# EAGLE schematic Wheel_Encoder_Adapter_Schmitt_7414 (EAGLE 7.1.0)
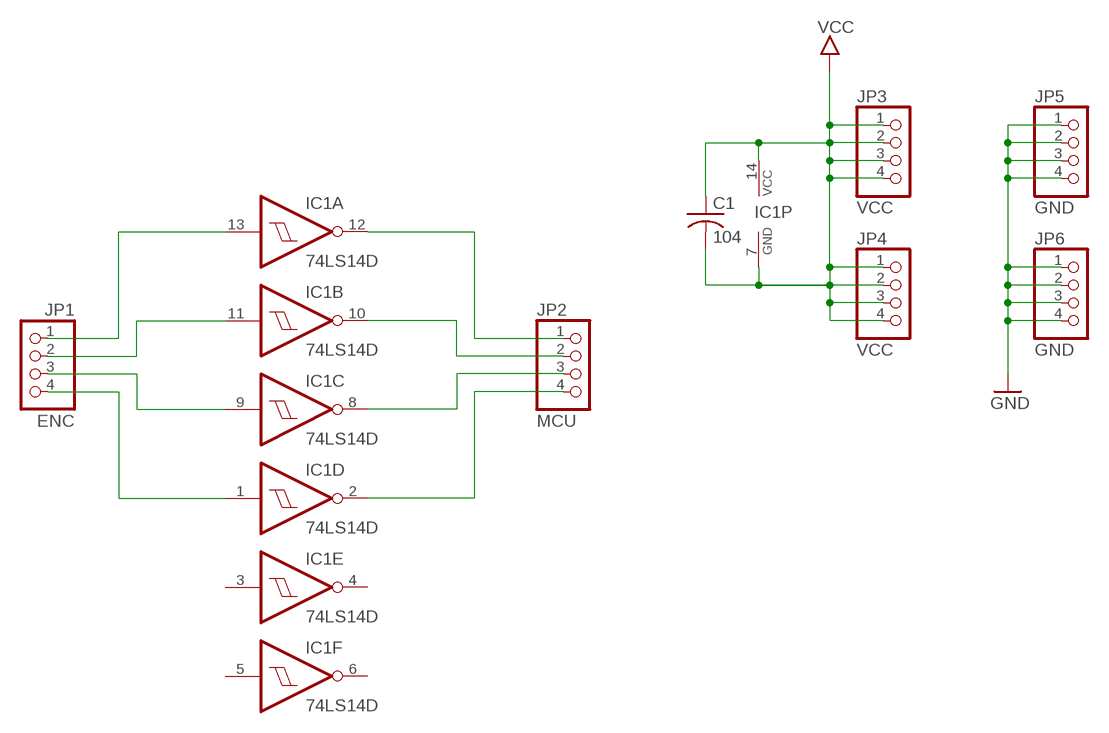
[diagram p0: schematic, sheet 1]

## Parts
C1  104  C-USC0603  [C0603]
IC1  74LS14D  [SO14]
JP1  ENC  PINHD-1X04_2.54-S  [1X04-S]
JP2  MCU  PINHD-1X04_2.54-S  [1X04-S]
JP3  VCC  PINHD-1X04_2.54-S  [1X04-S]
JP4  VCC  PINHD-1X04_2.54-S  [1X04-S]
JP5  GND  PINHD-1X04_2.54-S  [1X04-S]
JP6  GND  PINHD-1X04_2.54-S  [1X04-S]

## Nets
GND: JP5.1 JP5.2 JP5.3 JP5.4 JP6.1 JP6.2 JP6.3 JP6.4
N$1: IC1.13(A:I) JP1.1
N$2: IC1.1(D:I) JP1.4
N$3: IC1.12(A:O) JP2.1
N$4: IC1.2(D:O) JP2.4
N$5: IC1.8(C:O) JP2.3
N$6: IC1.10(B:O) JP2.2
N$7: IC1.11(B:I) JP1.2
N$8: IC1.9(C:I) JP1.3
VCC: C1.1 C1.2 IC1.7(P:GND) IC1.14(P:VCC) JP3.1 JP3.2 JP3.3 JP3.4 JP4.1 JP4.2 JP4.3 JP4.4
Unconnected: IC1.3(E:I) IC1.4(E:O) IC1.5(F:I) IC1.6(F:O)

## Library data of the parts
C1 = rcl:C-US: CAPACITOR, American symbol
IC1 = 74xx-eu:74*14: Hex schmitt trigger INVERTER
JP1-JP6 = pinhead-2:PINHD-1X04: PIN HEADER